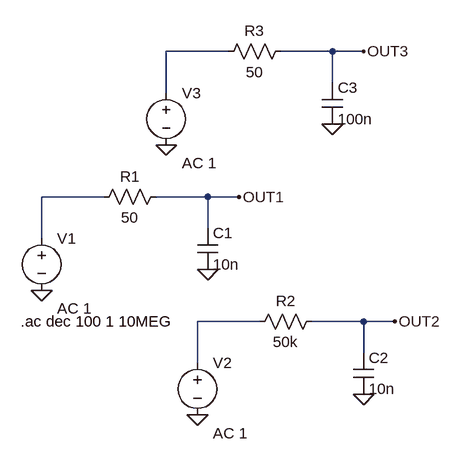
[diagram p0: schematic low_pass_filter.asc]
low_pass_filter.asc, the LTspice schematic file:
Version 4.1
SHEET 1 880 680
WIRE 272 -112 176 -112
WIRE 432 -112 352 -112
WIRE 480 -112 432 -112
WIRE 432 -64 432 -112
WIRE 176 -48 176 -112
WIRE 80 112 -16 112
WIRE 240 112 160 112
WIRE 288 112 240 112
WIRE 240 160 240 112
WIRE -16 176 -16 112
WIRE 320 304 224 304
WIRE 480 304 400 304
WIRE 528 304 480 304
WIRE 480 352 480 304
WIRE 224 368 224 304
FLAG -16 256 0
FLAG 240 224 0
FLAG 288 112 OUT1
FLAG 224 448 0
FLAG 480 416 0
FLAG 528 304 OUT2
FLAG 176 32 0
FLAG 432 0 0
FLAG 480 -112 OUT3
SYMBOL cap 224 160 R0
SYMATTR InstName C1
SYMATTR Value 10n
SYMBOL res 176 96 R90
WINDOW 0 0 56 VBottom 2
WINDOW 3 32 56 VTop 2
SYMATTR InstName R1
SYMATTR Value 50
SYMBOL voltage -16 160 R0
WINDOW 123 24 124 Left 2
WINDOW 39 0 0 Left 0
SYMATTR Value2 AC 1
SYMATTR InstName V1
SYMATTR Value ""
SYMBOL cap 464 352 R0
SYMATTR InstName C2
SYMATTR Value 10n
SYMBOL res 416 288 R90
WINDOW 0 0 56 VBottom 2
WINDOW 3 32 56 VTop 2
SYMATTR InstName R2
SYMATTR Value 50k
SYMBOL voltage 224 352 R0
WINDOW 123 24 124 Left 2
WINDOW 39 0 0 Left 0
SYMATTR Value2 AC 1
SYMATTR InstName V2
SYMATTR Value ""
SYMBOL cap 416 -64 R0
SYMATTR InstName C3
SYMATTR Value 100n
SYMBOL voltage 176 -64 R0
WINDOW 123 24 124 Left 2
WINDOW 39 0 0 Left 0
SYMATTR Value2 AC 1
SYMATTR InstName V3
SYMATTR Value ""
SYMBOL res 368 -128 R90
WINDOW 0 0 56 VBottom 2
WINDOW 3 32 56 VTop 2
SYMATTR InstName R3
SYMATTR Value 50
TEXT -48 304 Left 2 !.ac dec 100 1 10MEG

The netlist it stands for:
* low_pass_filter.asc
C1 OUT1 0 10n
R1 OUT1 N002 50
V1 N002 0 AC 1
C2 OUT2 0 10n
R2 OUT2 N003 50k
V2 N003 0 AC 1
C3 OUT3 0 100n
V3 N001 0 AC 1
R3 OUT3 N001 50
.ac dec 100 1 10MEG
.backanno
.end

* Results of the author's LTspice run, read from the files saved beside the schematic
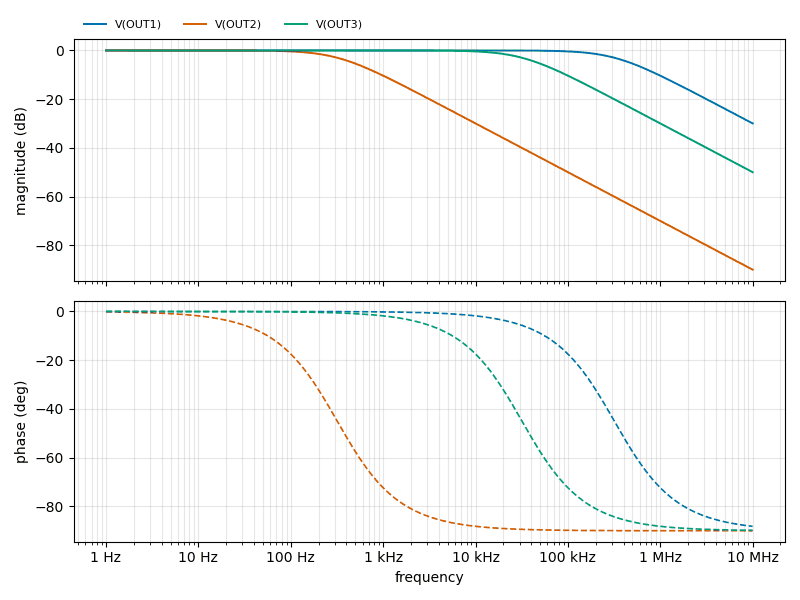
[diagram p1: AC Analysis of low_pass_filter.asc, plotted from the saved traces]
* AC Analysis, 1 run:
*   V(OUT1): -0.00 dB at 1 Hz, -29.95 dB at 10 MHz, peak -0.00 dB at 1 Hz, 3 dB below the peak at 318.3 kHz
*   V(OUT2): -0.00 dB at 1 Hz, -89.94 dB at 10 MHz, peak -0.00 dB at 1 Hz, 3 dB below the peak at 318.3 Hz
*   V(OUT3): -0.00 dB at 1 Hz, -49.94 dB at 10 MHz, peak -0.00 dB at 1 Hz, 3 dB below the peak at 31.83 kHz